# Altium schematic sheet RGMII0_ETH_PHY.SchDoc
size 420 x 297 mm; SheetNumber: 16; SheetTotal: 32; DocumentTypeShort: Э3; DocumentInvertoryNumber: ㅤ
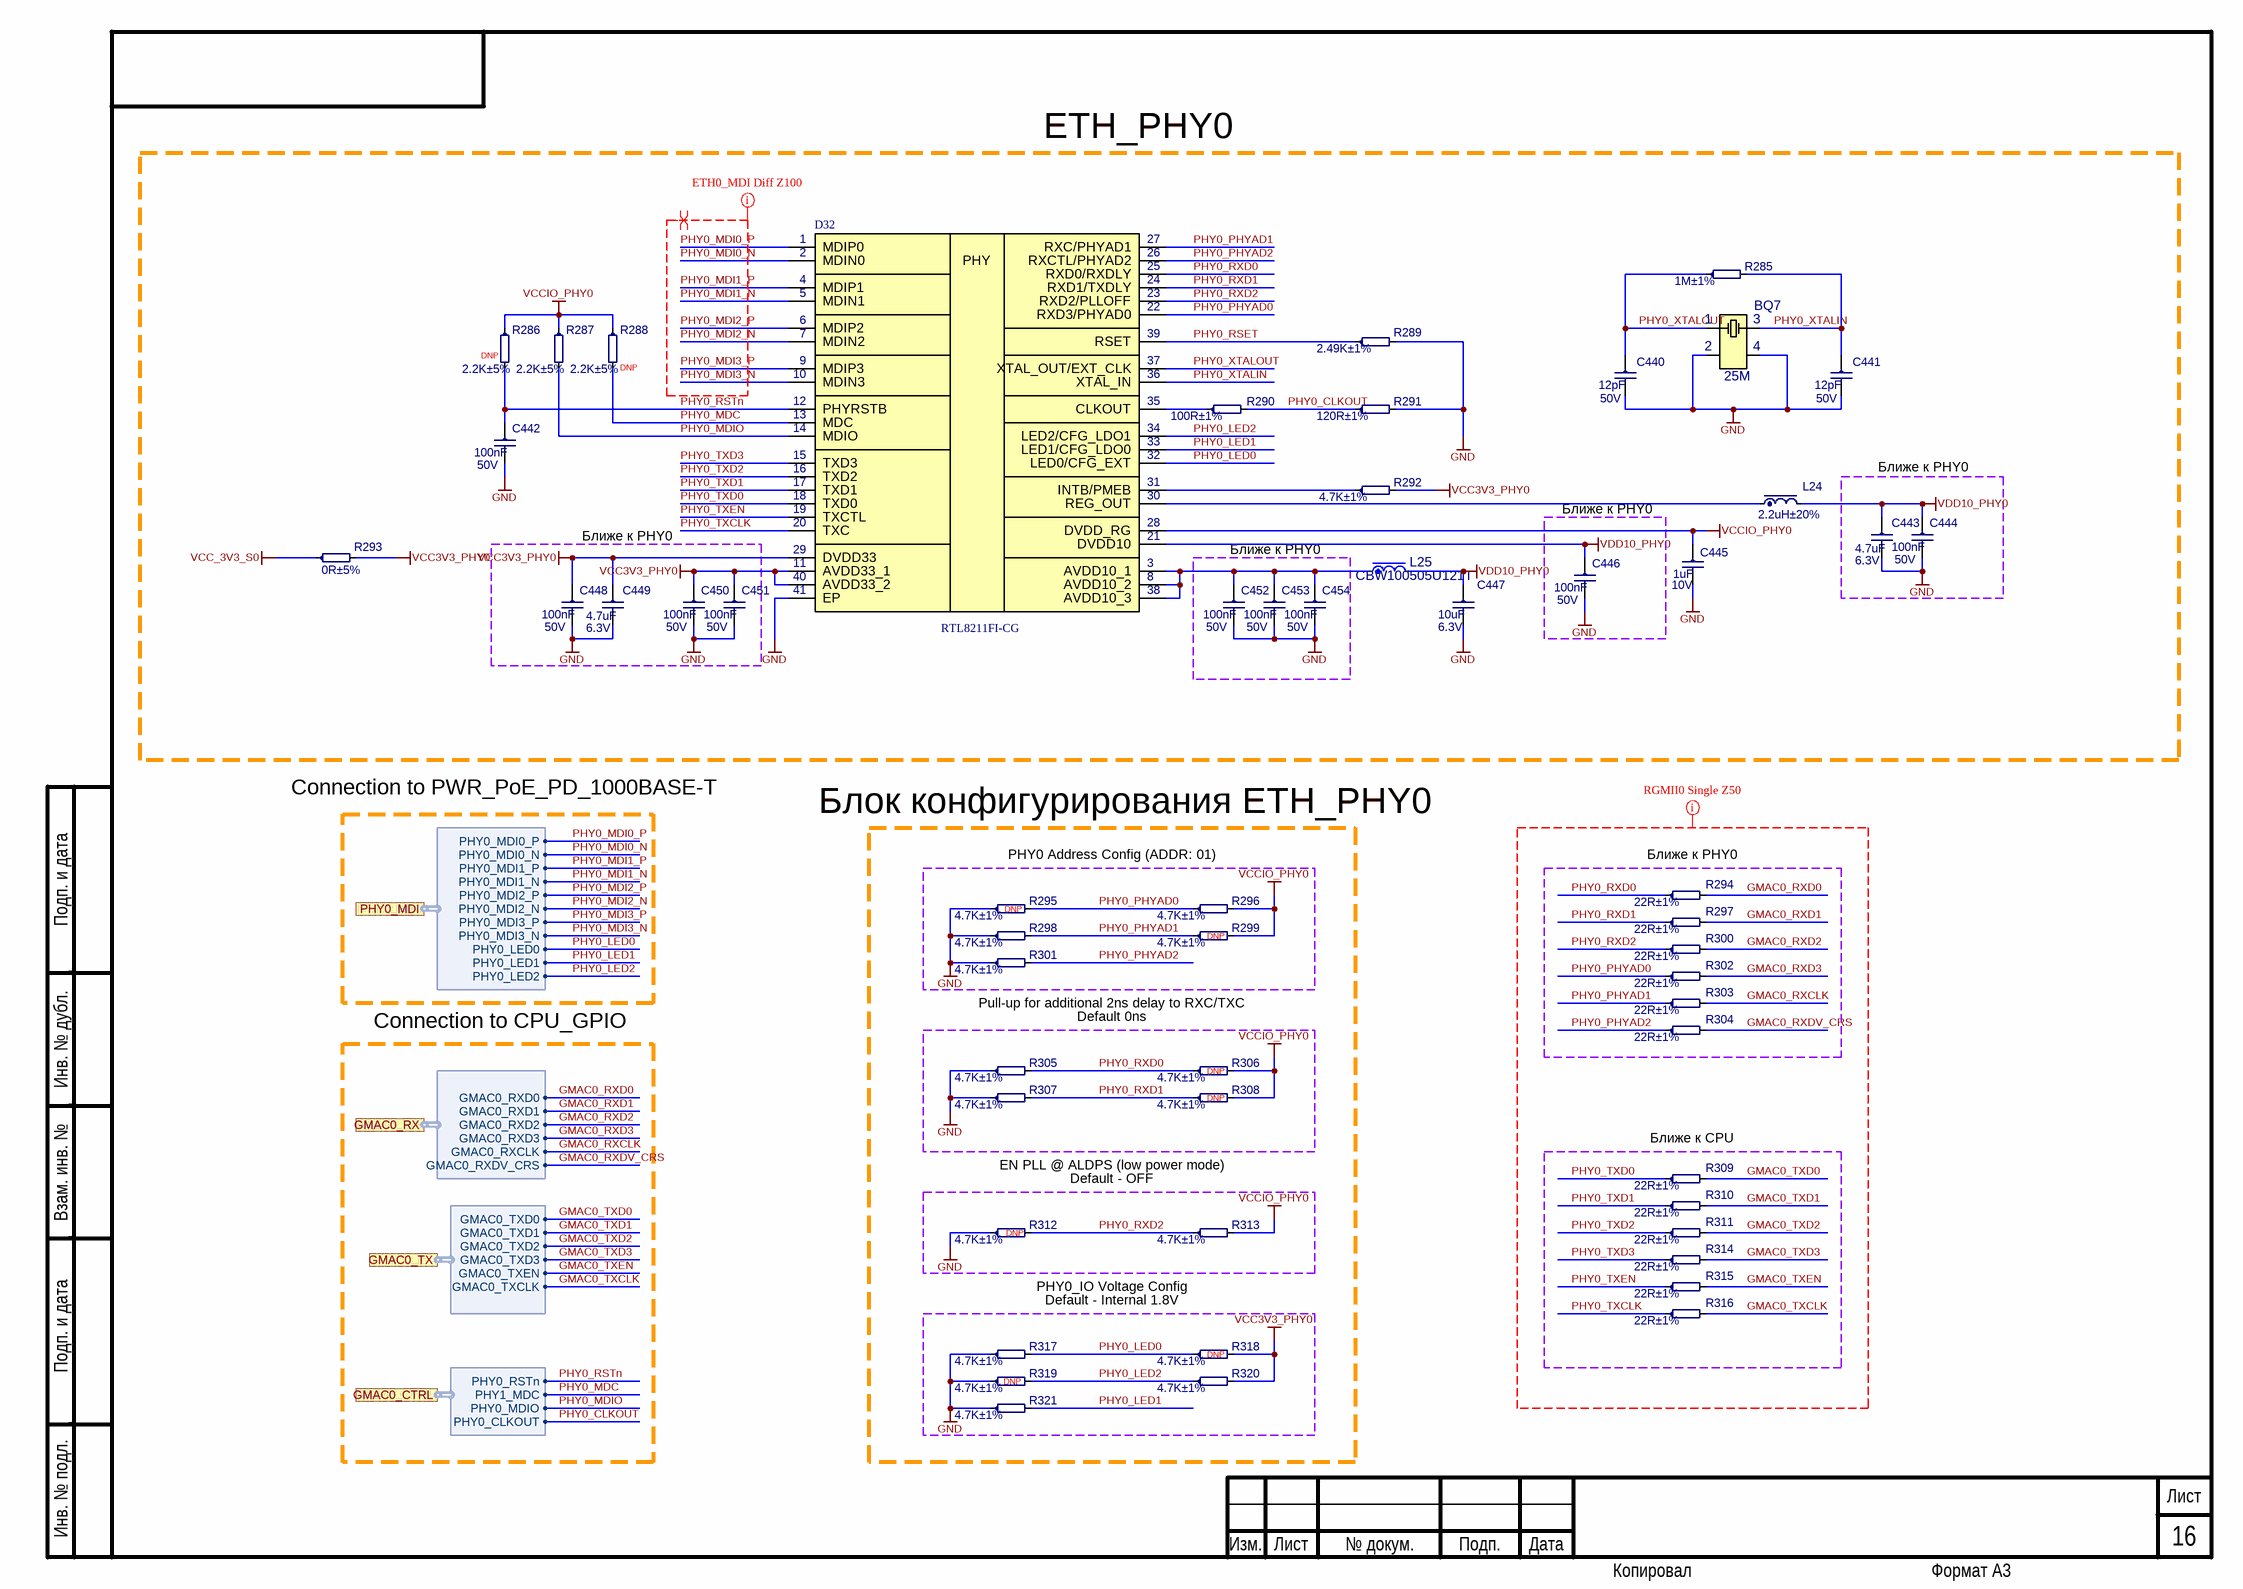
[diagram p0: RGMII0_ETH_PHY.SchDoc]

## Parts
BQ7  25M  [NX3225GA]
C440  12pF  Voltage: 50V  [C0402]
C441  12pF  Voltage: 50V  [C0402]
C442  100nF  Voltage: 50V  [C0402]
C443  4.7uF  Voltage: 6.3V  [C0402]
C444  100nF  Voltage: 50V  [C0402]
C445  1uF  Voltage: 10V  [C0402]
C446  100nF  Voltage: 50V  [C0402]
C447  10uF  Voltage: 6.3V  [C0402]
C448  100nF  Voltage: 50V  [C0402]
C449  4.7uF  Voltage: 6.3V  [C0402]
C450  100nF  Voltage: 50V  [C0402]
C451  100nF  Voltage: 50V  [C0402]
C452  100nF  Voltage: 50V  [C0402]
C453  100nF  Voltage: 50V  [C0402]
C454  100nF  Voltage: 50V  [C0402]
D32  RTL8211FI-CG  [RTL8211F-CG]
L24  2.2uH±20%  [L0806]
L25  CBW100505U121T  [L0402]
R285  1M±1%  [R0402]
R286  2.2K±5%  [R0402]
R287  2.2K±5%  [R0402]
R288  2.2K±5%  [R0402]
R289  2.49K±1%  [R0402]
R290  100R±1%  [R0402]
R291  120R±1%  [R0402]
R292  4.7K±1%  [R0402]
R293  0R±5%  [R0805]
R294  22R±1%  [R0402]
R295  4.7K±1%  [R0402]
R296  4.7K±1%  [R0402]
R297  22R±1%  [R0402]
R298  4.7K±1%  [R0402]
R299  4.7K±1%  [R0402]
R300  22R±1%  [R0402]
R301  4.7K±1%  [R0402]
R302  22R±1%  [R0402]
R303  22R±1%  [R0402]
R304  22R±1%  [R0402]
R305  4.7K±1%  [R0402]
R306  4.7K±1%  [R0402]
R307  4.7K±1%  [R0402]
R308  4.7K±1%  [R0402]
R309  22R±1%  [R0402]
R310  22R±1%  [R0402]
R311  22R±1%  [R0402]
R312  4.7K±1%  [R0402]
R313  4.7K±1%  [R0402]
R314  22R±1%  [R0402]
R315  22R±1%  [R0402]
R316  22R±1%  [R0402]
R317  4.7K±1%  [R0402]
R318  4.7K±1%  [R0402]
R319  4.7K±1%  [R0402]
R320  4.7K±1%  [R0402]
R321  4.7K±1%  [R0402]

## Blocks framed on the sheet
Ближе к PHY0: C446
Ближе к PHY0: C443 C444
Ближе к PHY0: C448-C451
Ближе к PHY0: C452-C454
PHY0 Address Config (ADDR: 01): R295 R296 R298 R299 R301
Ближе к PHY0: R294 R297 R300 R302-R304
Default 0ns: R305-R308
Ближе к CPU: R309-R311 R314-R316
Default - OFF: R312 R313
Default - Internal 1.8V: R317-R321

## Ports
GMAC0_CTRL (harness GMAC0_CTRL), GMAC0_RX (harness GMAC0_RX), GMAC0_TX (harness GMAC0_TX), PHY0_MDI (harness PHY0_MDI)

## Harnesses
GMAC0_RX: GMAC0_RXD1, GMAC0_RXD2, GMAC0_RXD3, GMAC0_RXD0, GMAC0_RXCLK, GMAC0_RXDV_CRS
GMAC0_TX: GMAC0_TXD1, GMAC0_TXD2, GMAC0_TXD3, GMAC0_TXD0, GMAC0_TXEN, GMAC0_TXCLK
GMAC0_CTRL: PHY0_RSTn, PHY1_MDC, PHY0_MDIO, PHY0_CLKOUT
PHY0_MDI: PHY0_MDI0_N, PHY0_MDI1_P, PHY0_MDI1_N, PHY0_MDI2_P, PHY0_MDI0_P, PHY0_MDI2_N, PHY0_MDI3_P, PHY0_MDI3_N, PHY0_LED0, PHY0_LED1, PHY0_LED2

## Nets
GND: BQ7.2 BQ7.4 C440.2 C441.2 C442.2 C443.2 C444.2 C445.2 C446.2 C447.2 C448.2 C449.2 C450.2 C451.2 C452.2 C453.2 C454.2 D32.41(EP) R289.2 R291.2 R295.1 R298.1 R301.1 R305.1 R307.1 R312.1 R317.1 R319.1 R321.1
VCC3V3_PHY0: C448.1 C449.1 C450.1 C451.1 D32.11(AVDD33_1) D32.29(DVDD33) D32.40(AVDD33_2) R292.2 R293.2 R318.2 R320.2
VCC_3V3_S0: R293.1
VCCIO_PHY0: C445.1 D32.28(DVDD_RG) R286.1 R287.1 R288.1 R296.2 R299.2 R306.2 R308.2 R313.2
VDD10_PHY0: C443.1 C444.1 C446.1 C447.1 D32.21(DVDD10) L24.2 L25.2
GMAC0_RXCLK: R303.2 ; port GMAC0_RX.GMAC0_RXCLK
GMAC0_RXD0: R294.2 ; port GMAC0_RX.GMAC0_RXD0
GMAC0_RXD1: R297.2 ; port GMAC0_RX.GMAC0_RXD1
GMAC0_RXD2: R300.2 ; port GMAC0_RX.GMAC0_RXD2
GMAC0_RXD3: R302.2 ; port GMAC0_RX.GMAC0_RXD3
GMAC0_RXDV_CRS: R304.2 ; port GMAC0_RX.GMAC0_RXDV_CRS
GMAC0_TXCLK: R316.2 ; port GMAC0_TX.GMAC0_TXCLK
GMAC0_TXD0: R309.2 ; port GMAC0_TX.GMAC0_TXD0
GMAC0_TXD1: R310.2 ; port GMAC0_TX.GMAC0_TXD1
GMAC0_TXD2: R311.2 ; port GMAC0_TX.GMAC0_TXD2
GMAC0_TXD3: R314.2 ; port GMAC0_TX.GMAC0_TXD3
GMAC0_TXEN: R315.2 ; port GMAC0_TX.GMAC0_TXEN
PHY0_CLKOUT: R290.2 R291.1 ; port GMAC0_CTRL.PHY0_CLKOUT
PHY0_LED0: D32.32(LED0/CFG_EXT) R317.2 R318.1 ; port PHY0_MDI.PHY0_LED0
PHY0_LED1: D32.33(LED1/CFG_LDO0) R321.2 ; port PHY0_MDI.PHY0_LED1
PHY0_LED2: D32.34(LED2/CFG_LDO1) R319.2 R320.1 ; port PHY0_MDI.PHY0_LED2
PHY0_MDC: D32.13(MDC) R288.2 ; port GMAC0_CTRL.PHY1_MDC
PHY0_MDI0_N: D32.2(MDIN0) ; port PHY0_MDI.PHY0_MDI0_N
PHY0_MDI0_P: D32.1(MDIP0) ; port PHY0_MDI.PHY0_MDI0_P
PHY0_MDI1_N: D32.5(MDIN1) ; port PHY0_MDI.PHY0_MDI1_N
PHY0_MDI1_P: D32.4(MDIP1) ; port PHY0_MDI.PHY0_MDI1_P
PHY0_MDI2_N: D32.7(MDIN2) ; port PHY0_MDI.PHY0_MDI2_N
PHY0_MDI2_P: D32.6(MDIP2) ; port PHY0_MDI.PHY0_MDI2_P
PHY0_MDI3_N: D32.10(MDIN3) ; port PHY0_MDI.PHY0_MDI3_N
PHY0_MDI3_P: D32.9(MDIP3) ; port PHY0_MDI.PHY0_MDI3_P
PHY0_MDIO: D32.14(MDIO) R287.2 ; port GMAC0_CTRL.PHY0_MDIO
PHY0_PHYAD0: D32.22(RXD3/PHYAD0) R295.2 R296.1 R302.1
PHY0_PHYAD1: D32.27(RXC/PHYAD1) R298.2 R299.1 R303.1
PHY0_PHYAD2: D32.26(RXCTL/PHYAD2) R301.2 R304.1
PHY0_RSET: D32.39(RSET) R289.1
PHY0_RSTn: C442.1 D32.12(PHYRSTB) R286.2 ; port GMAC0_CTRL.PHY0_RSTn
PHY0_RXD0: D32.25(RXD0/RXDLY) R294.1 R305.2 R306.1
PHY0_RXD1: D32.24(RXD1/TXDLY) R297.1 R307.2 R308.1
PHY0_RXD2: D32.23(RXD2/PLLOFF) R300.1 R312.2 R313.1
PHY0_TXCLK: D32.20(TXC) R316.1
PHY0_TXD0: D32.18(TXD0) R309.1
PHY0_TXD1: D32.17(TXD1) R310.1
PHY0_TXD2: D32.16(TXD2) R311.1
PHY0_TXD3: D32.15(TXD3) R314.1
PHY0_TXEN: D32.19(TXCTL) R315.1
PHY0_XTALIN: BQ7.3 C441.1 D32.36(XTAL_IN) R285.2
PHY0_XTALOUT: BQ7.1 C440.1 D32.37(XTAL_OUT/EXT_CLK) R285.1
NetC452_1: C452.1 C453.1 C454.1 D32.3(AVDD10_1) D32.8(AVDD10_2) D32.38(AVDD10_3) L25.1
NetD32_30: D32.30(REG_OUT) L24.1
NetD32_31: D32.31(INTB/PMEB) R292.1
NetD32_35: D32.35(CLKOUT) R290.1

## Layout directives
net class ETH0_MDI: PHY0_MDI0_N, PHY0_MDI0_P, PHY0_MDI1_N, PHY0_MDI1_P, PHY0_MDI2_N, PHY0_MDI2_P, PHY0_MDI3_N, PHY0_MDI3_P
net class RGMII0: GMAC0_RXCLK, GMAC0_RXD0, GMAC0_RXD1, GMAC0_RXD2, GMAC0_RXD3, GMAC0_RXDV_CRS, GMAC0_TXCLK, GMAC0_TXD0, GMAC0_TXD1, GMAC0_TXD2, GMAC0_TXD3, GMAC0_TXEN, PHY0_PHYAD0, PHY0_PHYAD1, PHY0_PHYAD2, PHY0_RXD0, PHY0_RXD1, PHY0_RXD2, PHY0_TXCLK, PHY0_TXD0, PHY0_TXD1, PHY0_TXD2, PHY0_TXD3, PHY0_TXEN
differential pair; differential pair class Diff_Z100: PHY0_MDI0_N, PHY0_MDI0_P, PHY0_MDI1_N, PHY0_MDI1_P, PHY0_MDI2_N, PHY0_MDI2_P, PHY0_MDI3_N, PHY0_MDI3_P

## Notes on the sheet
- ETH_PHY0
- (near R286) DNP
- (near R288) DNP
- Connection to PWR_PoE_PD_1000BASE-T
- Блок конфигурирования ETH_PHY0
- (near R295) DNP
- (near R299) DNP
- (near R301) Pull-up for additional 2ns delay to RXC/TXC
- Connection to CPU_GPIO
- (near R306) DNP
- (near R308) DNP
- EN PLL @ ALDPS (low power mode)
- (near R312) DNP
- PHY0_IO Voltage Config
- (near R319) DNP
- (near R318) DNP
- Подп. и дата
- Инв. № дубл.
- Взам. инв. №
- Инв. № подл.
- Изм.
- Лист
- № докум.
- Подп.
- Дата
- Копировал
- Формат А3
- (in symbol RTL8211F-CG) PHY

## Library data of the parts
BQ7 = E3SB25E00000DE: 25MHz 10pF ±10ppm SMD3225-4P; Part Number: TAXM25M4RDBCCT2T; Manufacturer: Yajingxin; Place: S; Check: False; Value: 25M; Temperature: -40°C~85°C; Tolerance: 10ppm; NameFromManufacturer: TAXM25M4RDBCCT2T; Last changed: 18.04.2023
C440 C441 = 0402-NP0-50V-12pF±5%: Manufacturer: Murata Electronics; NameFromManufacturer: GRM1555C1H120JA01D; Dielectric: NP0; Place: *); Tolerance: 5%; Check: False; Case: C0402; Part Number: 0402-NP0-50V-12pF±5%; Value: 12pF; Temperature: -55°C~125°C; ComponentLink2Description: Link to datasheet; ComponentLink1Description: DATASHEET; ComponentLink2URL: https://www.terraelectronica.ru/pdf/show?pdf_file=http%253A%252F%252Fwww.farnell.com%252Fdatasheets%252F2048662.pdf; ComponentLink1URL: Datasheets/capacitors/GRM1555C1H120JA01-01A.pdf; Last changed: 27.10.2022
C442 C444 C446 C448 C450-C454 = 0402-X7R-50V-0.1uF±10%: Ceramic Capacitor 0402 100nF ±10% 50V X7R; Manufacturer: Yageo; NameFromManufacturer: CC0402KRX7R9BB104; Place: *); Check: False; Dielectric: X7R; Case: C0402; Part Number: 0402-X7R-50V-0.1uF±10%; Value: 100nF; Tolerance: 10%; Temperature: -55°C~125°C; ComponentLink2Description: Link to datasheet; ComponentLink1Description: DATASHEET; ComponentLink2URL: https://www.lcsc.com/product-detail/Multilayer-Ceramic-Capacitors-MLCC-SMD-SMT_YAGEO-CC0402KRX7R9BB104_C131394.html; Last changed: 09.04.2025
C443 C449 = 0402-X5R-6.3V-4.7uF±20%: Ceramic Capacitor 0402 4.7uF ±20% 6.3V X5R; Manufacturer: Yageo; NameFromManufacturer: CC0402MRX5R5BB475; Place: *); Check: False; Dielectric: X5R; Case: C0402; Part Number: 0402-X5R-6.3V-4.7uF±20%; Value: 4.7uF; Tolerance: 20%; Temperature: -55°C~125°C; ComponentLink2Description: Link to datasheet; ComponentLink1Description: DATASHEET; ComponentLink2URL: https://ru.mouser.com/ProductDetail/YAGEO/CC0402MRX5R5BB475?qs=%2Fha2pyFadujQAk9rG2cgJpeZ0BKEEZe0MyMZqMwsns5cG502XdwDVw%3D%3D; ComponentLink1URL: Datasheets/capacitors/UPY-GPHC_X5R_4V-to-50V_27.pdf; Last changed: 27.10.2022
C445 = 0402-X5R-10V-1uF±10%: Manufacturer: Samsung; NameFromManufacturer: CL05A105KP5NNNC; Dielectric: X5R; Place: *); Tolerance: 10%; Check: False; Case: C0402; Part Number: 0402-X5R-10V-1uF±10%; Value: 1uF; Temperature: -55°C~85°C; ComponentLink2Description: Link to datasheet; ComponentLink1Description: DATASHEET; ComponentLink2URL: https://datasheet.ciiva.com/15195/getdatasheetpartid-358390-15195630.pdf?src-supplier=Verical; ComponentLink1URL: Datasheets/capacitors/getdatasheetpartid-358390-15195630.pdf; Last changed: 27.10.2022
C447 = 0402-X5R-6.3V-10uF±20%: Manufacturer: Yageo; NameFromManufacturer: CC0402MRX5R5BB106; Dielectric: X5R; Place: *); Tolerance: 20%; Check: False; Case: C0402; Part Number: 0402-X5R-6.3V-10uF±20%; Value: 10uF; Temperature: -55°C~125°C; ComponentLink2Description: Link to datasheet; ComponentLink1Description: DATASHEET; ComponentLink2URL: https://ru.mouser.com/ProductDetail/YAGEO/CC0402MRX5R5BB106?qs=%2Fha2pyFadujQAk9rG2cgJj8l7IbODD3KVaDjvxAcKzu9LtlLnRlq6Q%3D%3D; ComponentLink1URL: Datasheets/capacitors/UPY-GPHC_X5R_4V-to-50V_27.pdf; Last changed: 27.10.2022
D32 = RTL8211F-CG: Phy 1-CH 10MBPS/100MBPS/1GBPS 3.3V 40-PIN QFN; Manufacturer: Realtek Semicon; Check: False; Part Number: RTL8211FI-CG; Value: RTL8211FI-CG; NameFromManufacturer: RTL8211FI-CG; ComponentLink1Description: DATASHEET; Last changed: 24.03.2023
L24 = 0806-2.1A-15uH±20%: Manufacturer: Murata Electronics; NameFromManufacturer: DFE201612E-2R2M=P2; Current: 2.1A; Place: *); Value: 2.2uH; Tolerance: 20%; DC Resistance: 0.116R; Check: False; Case: XXXX; Part Number: 0806-2.1A-15uH±20%; Temperature: -55°C~125°C; ComponentLink1Description: DATASHEET; ComponentLink1URL: https://www.terraelectronica.ru/product/3410097; Datasheet: Datasheets/inductors/J(E)TE243A-0006.pdf; Last changed: 27.10.2022
L25 = BLM15EG121SN1D: 120Ω@100MHz  Ferrite Beads; Manufacturer: Murata Electronics; Place: S; Tolerance: 25%; DC Resistance: 0.095R; Check: False; Analog: UPZ1005D121-1R3TF, CBW100505U121T, BLM15EG121SN1D; Part Number: CBW100505U121T; Value: CBW100505U121T; Temperature: -40°C~85°C; NameFromManufacturer: CBW100505U121T; Last changed: 18.04.2023
R285 = 0402-0.0625W-1M-100ppm±1%: Chip Resistor 0402 1MΩ ±1% 50V ±100ppm/℃ Thick Film; NameFromManufacturer: RC0402FR-071ML; Manufacturer: Yageo; Place: *); Value: 1M; Check: False; Case: R0402; Part Number: 0402-0.0625W-1M-100ppm±1%; Tolerance: 1%; Temperature: -55°C~155°C; ComponentLink1Description: DATASHEET; ComponentLink1URL: https://www.yageo.com/upload/media/product/productsearch/datasheet/rchip/PYu-RC_Group_51_RoHS_L_11.pdf; Datasheet: Datasheets/resistors/PYu-RC_Group_51_RoHS_L_11.pdf; Last changed: 27.10.2022
R286-R288 = 0402-0.0625W-2.2K-100ppm±5%: *; NameFromManufacturer: RC0402JR-072K2L; Manufacturer: Yageo; Place: *); Value: 2.2K; Tolerance: 5%; Check: False; Case: R0402; Part Number: 0402-0.0625W-2.2K-100ppm±5%; Temperature: -55°C~155°C; ComponentLink1Description: DATASHEET; ComponentLink1URL: https://octopart.com/ac0402jr-072k2l-yageo-23514430?r=sp; Datasheet: Datasheets/resistors/PYu-AC_51_RoHS_L_8.pdf; Last changed: 27.10.2022
R289 = 0402-0.0625W-2.49K-100ppm±1%: Chip Resistor 0402 2.49kΩ ±1% 50V ±100ppm/℃ Thick Film; NameFromManufacturer: RC0402FR-072K49L; Manufacturer: Yageo; Place: *); Value: 2.49K; Check: False; Case: R0402; Part Number: 0402-0.0625W-2.49K-100ppm±1%; Tolerance: 1%; Temperature: -55°C~155°C; ComponentLink1Description: DATASHEET; ComponentLink1URL: https://www.electronshik.ru/item/YAG/RC0402FR-072K49L; Datasheet: Datasheets/resistors/PYu-RC_Group_51_RoHS_L_12.pdf; Last changed: 27.10.2022
R290 = 0402-0.0625W-100R-100ppm±1%: Chip Resistor 0402 100Ω ±1% 50V ±100ppm/℃ Thick Film; NameFromManufacturer: RC0402FR-07100RL; Manufacturer: Yageo; Place: *); Value: 100R; Check: False; Case: R0402; Part Number: 0402-0.0625W-100R-100ppm±1%; Tolerance: 1%; Temperature: -55°C~155°C; ComponentLink1Description: DATASHEET; ComponentLink1URL: https://www.yageo.com/upload/media/product/productsearch/datasheet/rchip/PYu-RC_Group_51_RoHS_L_11.pdf; Datasheet: Datasheets/resistors/PYu-RC_Group_51_RoHS_L_11.pdf; Last changed: 27.10.2022
R291 = 0402-0.0625W-120R-100ppm±1%: NameFromManufacturer: RC0402FR-07120RL; Manufacturer: Yageo; Place: *); Value: 120R; Tolerance: 1%; Check: False; Case: R0402; Part Number: 0402-0.0625W-120R-100ppm±1%; Temperature: -55°C~155°C; ComponentLink1Description: DATASHEET; ComponentLink1URL: https://www.electronshik.ru/item/YAG/RC0402FR-07120RL; Datasheet: chrome-extension://efaidnbmnnnibpcajpcglclefindmkaj/https://data.electronshik.ru/z/Datasheet/R/RC0402.pdf##; Last changed: 03.04.2023
R292 R295 R296 R298 R299 R301 R305-R308 R312 R313 R317-R321 = 0402-0.0625W-4.7K-100ppm±1%: NameFromManufacturer: RC0402FR-074K7L; Manufacturer: Yageo; Place: *); Value: 4.7K; Tolerance: 1%; Check: False; Case: R0402; Part Number: 0402-0.0625W-4.7K-100ppm±1%; Temperature: -55°C~155°C; ComponentLink1Description: DATASHEET; ComponentLink1URL: https://www.promelec.ru/product/229739/; Datasheet: Datasheets/resistors/PYu-RC_Group_51_RoHS_L_11.pdf; Last changed: 11.11.2022
R293 = 0805-0.125W-0R-250ppm±5%: NameFromManufacturer: RC0805JR-070RL; Manufacturer: Yageo; Place: *); Value: 0R; Tolerance: 5%; Check: False; Case: R0805; Part Number: 0805-0.125W-0R-250ppm±5%; Temperature: -55°C~155°C; ComponentLink1Description: DATASHEET; ComponentLink1URL: https://www.terraelectronica.ru/product/327233; Datasheet: Datasheets/resistors/PYu-RC_Group_51_RoHS_L_11.pdf; Last changed: 27.10.2022
R294 R297 R300 R302-R304 R309-R311 R314-R316 = 0402-0.0625W-22R-100ppm±1%: Chip Resistor 0402 22Ω ±1% 50V ±100ppm/℃ Thick Film; NameFromManufacturer: RC0402FR-0722RL; Manufacturer: Yageo; Place: *); Value: 22R; Check: False; Case: R0402; Part Number: 0402-0.0625W-22R-100ppm±1%; Tolerance: 1%; Temperature: -55°C~155°C; ComponentLink1Description: DATASHEET; ComponentLink1URL: https://www.yageo.com/upload/media/product/productsearch/datasheet/rchip/PYu-RC_Group_51_RoHS_L_11.pdf; Datasheet: Datasheets/resistors/PYu-RC_Group_51_RoHS_L_11.pdf; Last changed: 27.10.2022